# EAGLE schematic Sensor_post (EAGLE 7.6.0)
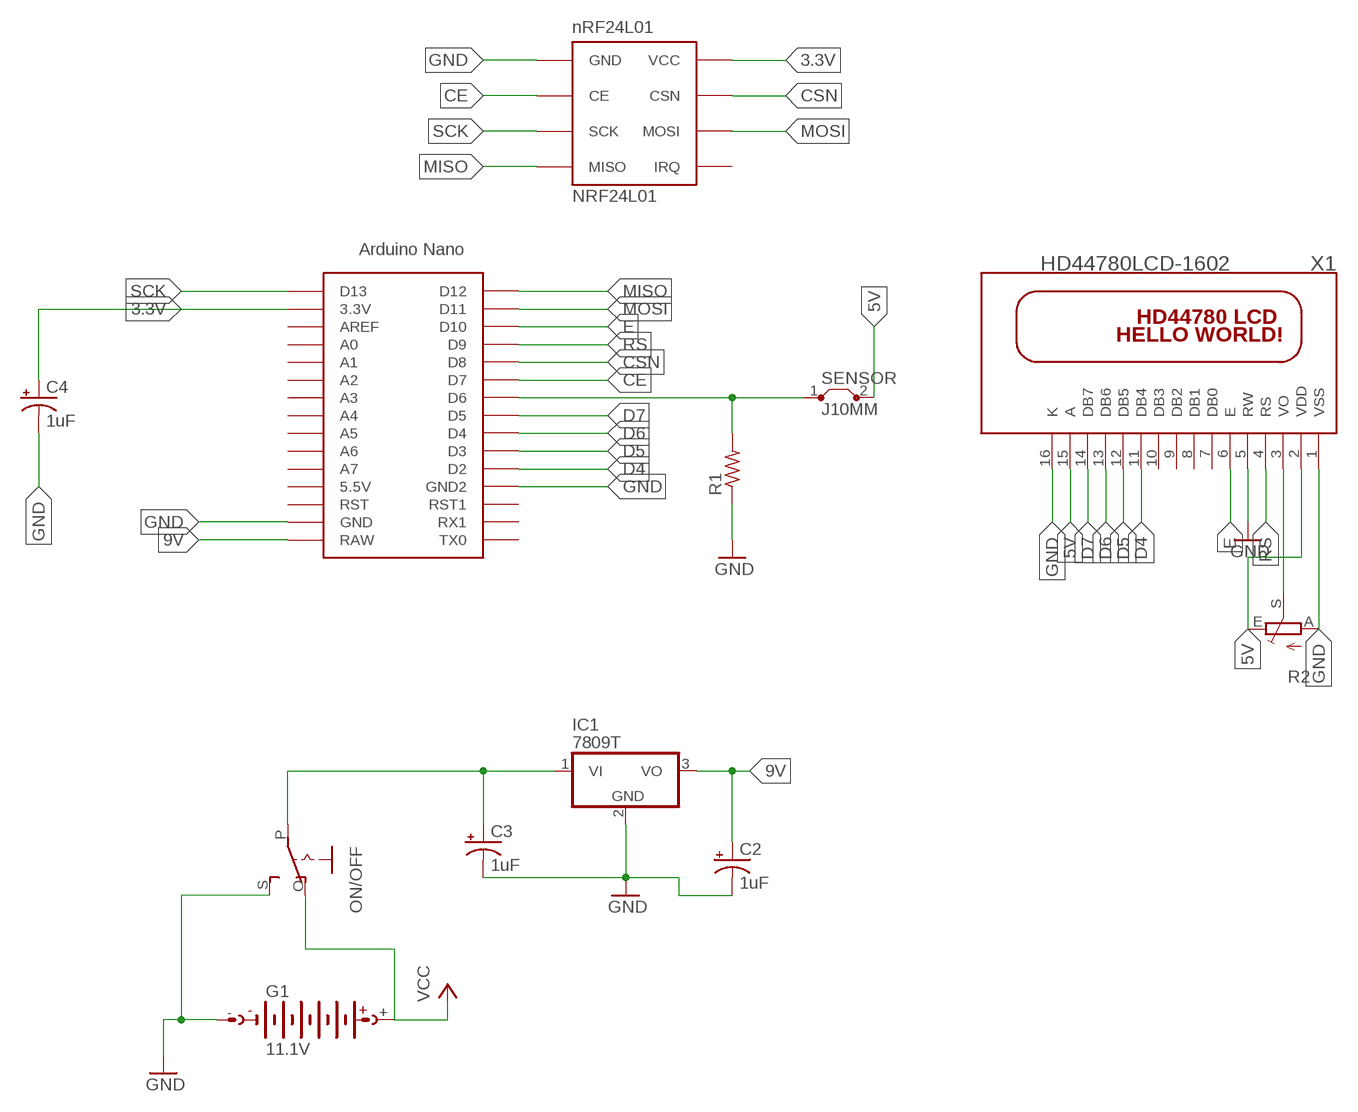
[diagram p0: schematic, sheet 1]

## Parts
C2  1uF  CPOL-USE2.5-7  [E2,5-7]
C3  1uF  CPOL-USE2.5-7  [E2,5-7]
C4  1uF  CPOL-USE2.5-7  [E2,5-7]
G1  11.1V  AB9V  [AB9V]
IC1  7809T  7805TV  [TO220V]
NRF24L1  NRF24L01  [NRF24L01]
ON/OFF  EG1218S  [EG1218]
R1  R-US_0207/10  [0207/10]
R2  TRIM_EU-CA9V  [CA9V]
SENSOR  J10MM  [10]
U$1  NANO  [NANO]
X1  HD44780LCD-1602  [LCD1602]

## Nets
3.3V: C4.+ NRF24L1.VCC U$1.3.3V
5V: R2.E SENSOR.2 X1.2(VDD) X1.15(A)
9V: C2.+ IC1.3(VO) U$1.RAW
CE: NRF24L1.CE U$1.D7
CSN: NRF24L1.CSN U$1.D8
D4: U$1.D2 X1.11(DB4)
D5: U$1.D3 X1.12(DB5)
D6: U$1.D4 X1.13(DB6)
D7: U$1.D5 X1.14(DB7)
E: U$1.D10 X1.6(E)
GND: C2.- C3.- C4.- G1.- IC1.2(GND) NRF24L1.GND ON/OFF.S R1.1 R2.A U$1.GND U$1.GND1(GND2) X1.1(VSS) X1.5(RW) X1.16(K)
MISO: NRF24L1.MISO U$1.D12
MOSI: NRF24L1.MOSI U$1.D11
N$1: C3.+ IC1.1(VI) ON/OFF.P
N$2: R1.2 SENSOR.1 U$1.D6
N$3: R2.S X1.3(VO)
RS: U$1.D9 X1.4(RS)
SCK: NRF24L1.SCK U$1.D13
VCC: G1.+ ON/OFF.O
Unconnected: NRF24L1.IRQ U$1.5V(5.5V) U$1.A0 U$1.A1 U$1.A2 U$1.A3 U$1.A4 U$1.A5 U$1.A6 U$1.A7 U$1.AREF U$1.RST U$1.RST1 U$1.RX1 U$1.TX0 X1.7(DB0) X1.8(DB1) X1.9(DB2) X1.10(DB3)

## Library data of the parts
C2-C4 = adafruit:CPOL-US: POLARIZED CAPACITOR, American symbol
G1 = battery:AB9V: 9-V BATTERY CLIP
IC1 = linear:78*: Positive VOLTAGE REGULATOR Source: http://cache.national.com/ds/LM/LM78L05.pdf http://www.fairchildsemi.com/ds/LM/LM7805.pdf
NRF24L1 = nRF24L01:NRF24L01: nRF24L01 module for 2.4 GHz communication dimension: 10x5 mm2 pinout: 1 - GND 2 - VCC 3- CE 4 - CSN 5 - SCK 6 - MOSI 7 - MISO 8 - IRQ
ON/OFF = adafruit:EG1218: SLIDING SWITCH 0.1" spacing through hole, vertical SPDT slide switch http://www.ladyada.net/library/pcb/eaglelibrary.html
R1 = adafruit:R-US_: RESISTOR, American symbol
R2 = pot:TRIM_EU-: POTENTIOMETER
SENSOR = jumper:J: Bridge
U$1 = Arduino-clone:NANO: Arduino Nano
X1 = adafruit:HD44780LCD: HD44780 LCD Standard character type LCDs, available in sizes from 8x1 to 40x4!